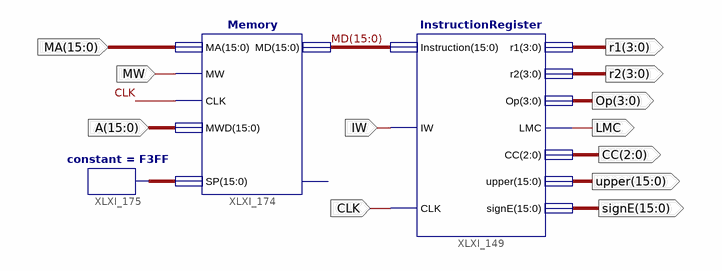
[diagram p0: schematic sheet 1]
// Xilinx ISE schematic IntegratedTestMemInstr.sch (spartan3e) as structural Verilog: 3 symbols, 12 ports
module IntegratedTestMemInstr (
  input  CLK,
  input  IW,
  input  [15:0] A,
  input  [15:0] MA,
  input  MW,
  output [3:0] Op,
  output [15:0] upper,
  output [15:0] signE,
  output LMC,
  output [2:0] CC,
  output [3:0] r1,
  output [3:0] r2
);

  wire [15:0] MD, SP;

  InstructionRegister XLXI_149 (
    .IW(IW), .CLK(CLK), .r1(r1), .r2(r2), .Instruction(MD), .signE(signE), .CC(CC), .upper(upper), .LMC(LMC),
    .Op(Op));
  Memory XLXI_174 (.MA(MA), .MW(MW), .CLK(CLK), .MWD(A), .MD(MD), .SP(SP));  // open: segFault
  constant #(.CValue("F3FF")) XLXI_175 (.O(SP));
endmodule
